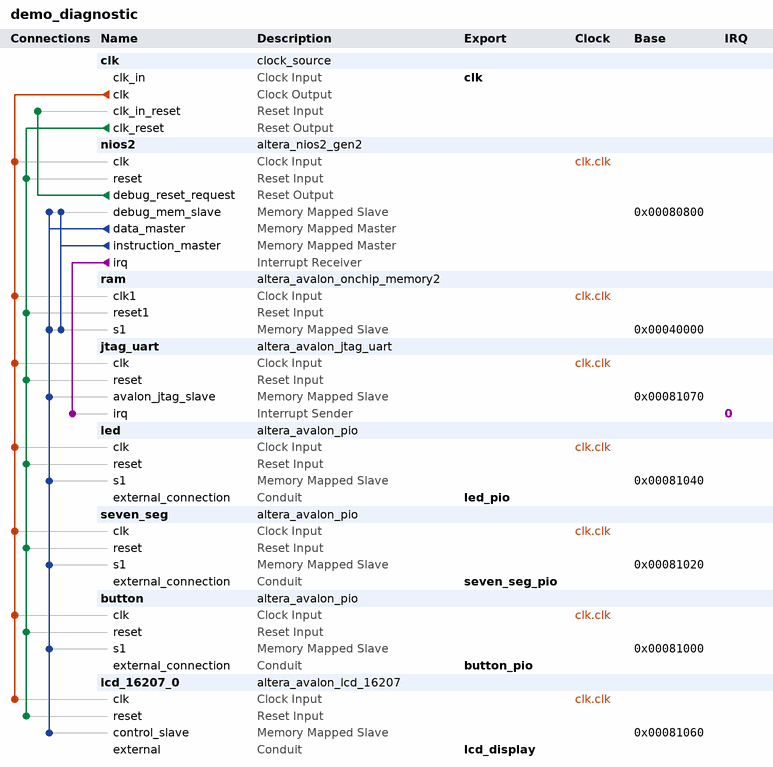
[diagram p0: system contents]
# Platform Designer (Qsys) system demo_diagnostic, Cyclone V 5CSEMA5F31C6
# Parameters at their usual value, and those the tool derives, are not listed.
package require -exact qsys 18.1
create_system demo_diagnostic
set_project_property DEVICE_FAMILY {Cyclone V}
set_project_property DEVICE 5CSEMA5F31C6

add_instance clk clock_source 18.1
set_instance_parameter_value clk clockFrequency 50000000

add_instance nios2 altera_nios2_gen2 18.1
set_instance_parameter_value nios2 dcache_size 2048
set_instance_parameter_value nios2 exceptionSlave ram.s1
set_instance_parameter_value nios2 icache_size 4096
set_instance_parameter_value nios2 impl Tiny
set_instance_parameter_value nios2 resetSlave ram.s1

add_instance ram altera_avalon_onchip_memory2 18.1
set_instance_parameter_value ram dataWidth 32
set_instance_parameter_value ram dualPort false
set_instance_parameter_value ram initMemContent true
set_instance_parameter_value ram initializationFileName onchip_mem.hex
set_instance_parameter_value ram memorySize 204800

add_instance jtag_uart altera_avalon_jtag_uart 18.1
set_instance_parameter_value jtag_uart simInteractiveOptions NO_INTERACTIVE_WINDOWS

add_instance led altera_avalon_pio 18.1
set_instance_parameter_value led bitModifyingOutReg true
set_instance_parameter_value led direction Output
set_instance_parameter_value led width 8

add_instance seven_seg altera_avalon_pio 18.1
set_instance_parameter_value seven_seg bitModifyingOutReg true
set_instance_parameter_value seven_seg direction Output
set_instance_parameter_value seven_seg width 8

add_instance button altera_avalon_pio 18.1
set_instance_parameter_value button bitModifyingOutReg true
set_instance_parameter_value button direction Output
set_instance_parameter_value button width 8

add_instance lcd_16207_0 altera_avalon_lcd_16207 18.1

# connections
add_connection clk.clk button.clk clock
add_connection clk.clk jtag_uart.clk clock
add_connection clk.clk lcd_16207_0.clk clock
add_connection clk.clk led.clk clock
add_connection clk.clk nios2.clk clock
add_connection clk.clk ram.clk1 clock
add_connection clk.clk seven_seg.clk clock
add_connection clk.clk_reset button.reset reset
add_connection clk.clk_reset jtag_uart.reset reset
add_connection clk.clk_reset lcd_16207_0.reset reset
add_connection clk.clk_reset led.reset reset
add_connection clk.clk_reset nios2.reset reset
add_connection clk.clk_reset ram.reset1 reset
add_connection clk.clk_reset seven_seg.reset reset
add_connection nios2.debug_reset_request clk.clk_in_reset reset
add_connection nios2.data_master button.s1 avalon
set_connection_parameter_value nios2.data_master/button.s1 baseAddress 0x00081000
add_connection nios2.data_master jtag_uart.avalon_jtag_slave avalon
set_connection_parameter_value nios2.data_master/jtag_uart.avalon_jtag_slave baseAddress 0x00081070
add_connection nios2.data_master lcd_16207_0.control_slave avalon
set_connection_parameter_value nios2.data_master/lcd_16207_0.control_slave baseAddress 0x00081060
add_connection nios2.data_master led.s1 avalon
set_connection_parameter_value nios2.data_master/led.s1 baseAddress 0x00081040
add_connection nios2.data_master nios2.debug_mem_slave avalon
set_connection_parameter_value nios2.data_master/nios2.debug_mem_slave baseAddress 0x00080800
add_connection nios2.data_master ram.s1 avalon
set_connection_parameter_value nios2.data_master/ram.s1 baseAddress 0x00040000
add_connection nios2.data_master seven_seg.s1 avalon
set_connection_parameter_value nios2.data_master/seven_seg.s1 baseAddress 0x00081020
add_connection nios2.instruction_master nios2.debug_mem_slave avalon
set_connection_parameter_value nios2.instruction_master/nios2.debug_mem_slave baseAddress 0x00080800
add_connection nios2.instruction_master ram.s1 avalon
set_connection_parameter_value nios2.instruction_master/ram.s1 baseAddress 0x00040000
add_connection nios2.irq jtag_uart.irq interrupt
set_connection_parameter_value nios2.irq/jtag_uart.irq irqNumber 0

# exported interfaces
add_interface button_pio conduit end
set_interface_property button_pio EXPORT_OF button.external_connection
add_interface clk clock sink
set_interface_property clk EXPORT_OF clk.clk_in
add_interface lcd_display conduit end
set_interface_property lcd_display EXPORT_OF lcd_16207_0.external
add_interface led_pio conduit end
set_interface_property led_pio EXPORT_OF led.external_connection
add_interface seven_seg_pio conduit end
set_interface_property seven_seg_pio EXPORT_OF seven_seg.external_connection

set_interconnect_requirement {$system} qsys_mm.clockCrossingAdapter HANDSHAKE
set_interconnect_requirement {$system} qsys_mm.enableEccProtection FALSE
set_interconnect_requirement {$system} qsys_mm.insertDefaultSlave FALSE
set_interconnect_requirement {$system} qsys_mm.maxAdditionalLatency 1

save_system demo_diagnostic.qsys
